# Altium schematic sheet RK3562-PMUIO-OSC-PLL.SchDoc
size 420 x 297 mm; SheetNumber: 6; SheetTotal: 32
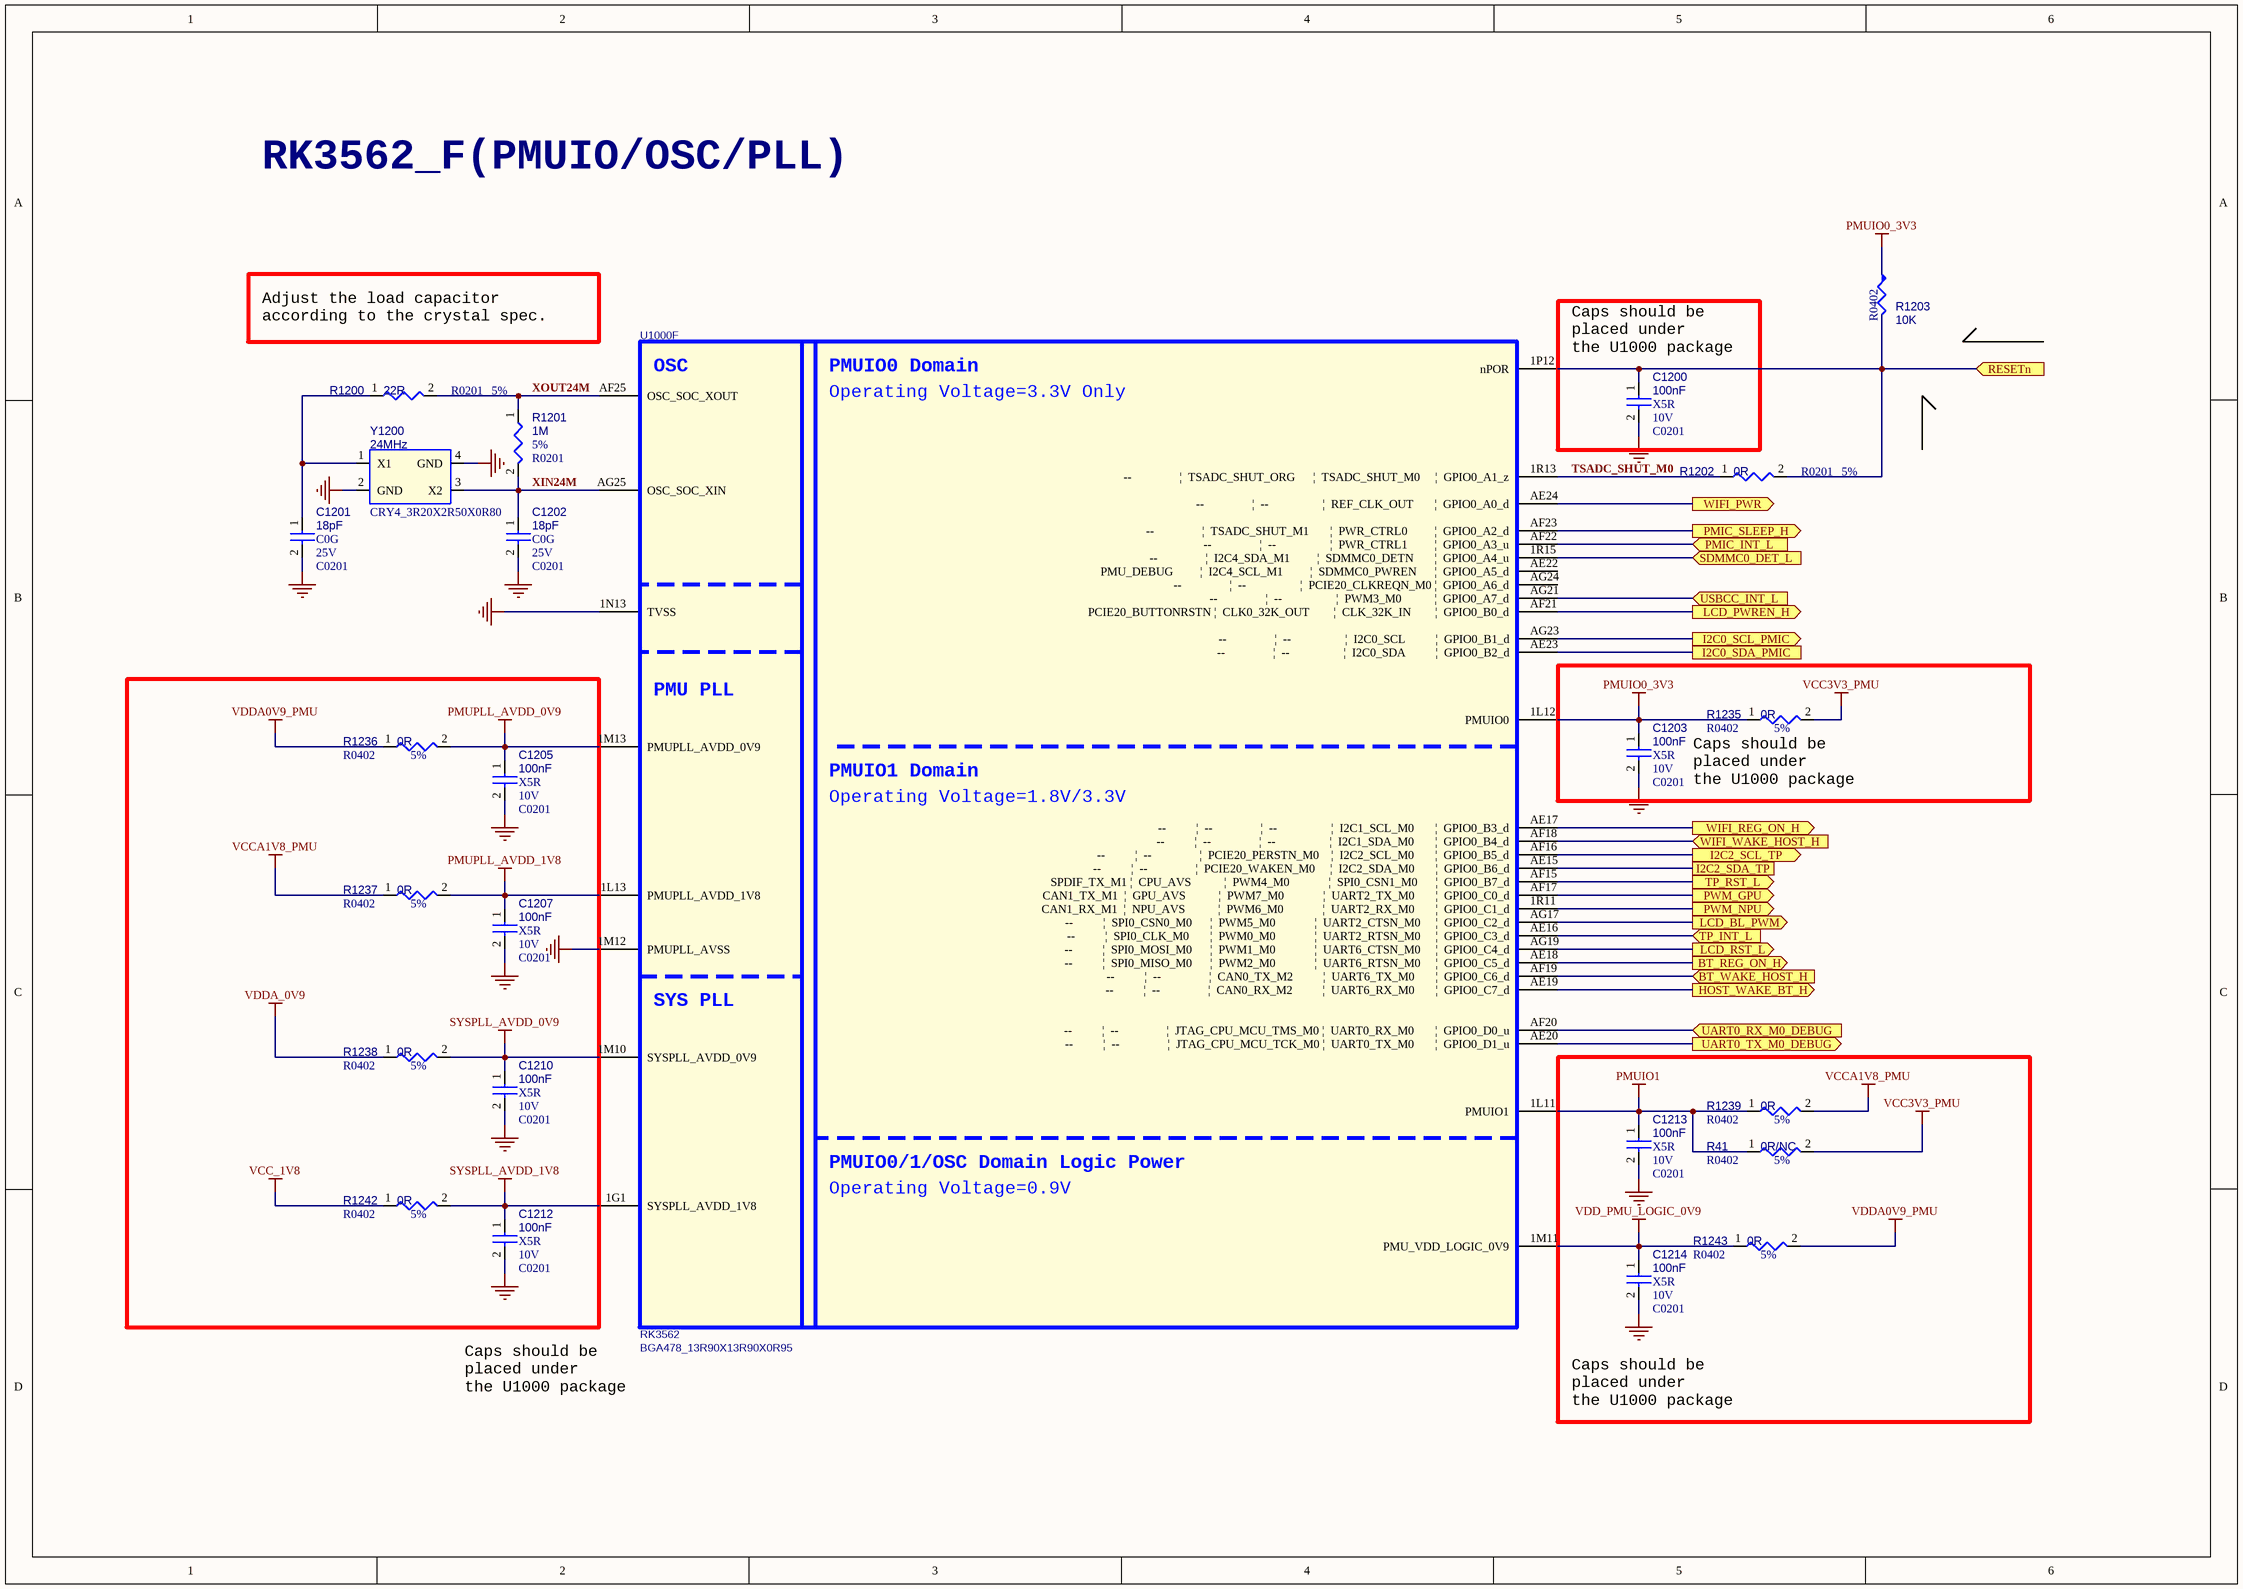
[diagram p0: RK3562-PMUIO-OSC-PLL.SchDoc]

## Parts
C1200  100nF  Dielectric: X5R  Voltage: 10V  [C0201]
C1201  18pF  Dielectric: C0G  Voltage: 25V  [C0201]
C1202  18pF  Dielectric: C0G  Voltage: 25V  [C0201]
C1203  100nF  Dielectric: X5R  Voltage: 10V  [C0201]
C1205  100nF  Dielectric: X5R  Voltage: 10V  [C0201]
C1207  100nF  Dielectric: X5R  Voltage: 10V  [C0201]
C1210  100nF  Dielectric: X5R  Voltage: 10V  [C0201]
C1212  100nF  Dielectric: X5R  Voltage: 10V  [C0201]
C1213  100nF  Dielectric: X5R  Voltage: 10V  [C0201]
C1214  100nF  Dielectric: X5R  Voltage: 10V  [C0201]
R41  0R/NC  Tolerance: 5%  [R0402]
R1200  22R  Tolerance: 5%  [R0201]
R1201  1M  Tolerance: 5%  [R0201]
R1202  0R  Tolerance: 5%  [R0201]
R1203  10K  [R0402]
R1235  0R  Tolerance: 5%  [R0402]
R1236  0R  Tolerance: 5%  [R0402]
R1237  0R  Tolerance: 5%  [R0402]
R1238  0R  Tolerance: 5%  [R0402]
R1239  0R  Tolerance: 5%  [R0402]
R1242  0R  Tolerance: 5%  [R0402]
R1243  0R  Tolerance: 5%  [R0402]
U1000  RK3562  [BGA478_13R90X13R90X0R95]  (part F of 16)
Y1200  24MHz  [CRY4_3R20X2R50X0R80]

## Ports
BT_REG_ON_H (out, see CONTROLLER-RK3562[6A], CONTROLLER-RK3562[7A], WF-BT-AP6256[1A]), BT_WAKE_HOST_H (in, see CONTROLLER-RK3562[6A], CONTROLLER-RK3562[7A], WF-BT-AP6256[1A]), HOST_WAKE_BT_H (out, see CONTROLLER-RK3562[6A], CONTROLLER-RK3562[7A], WF-BT-AP6256[1A]), I2C0_SCL_PMIC (out, see CONTROLLER-RK3562[6A], RK-POWER-SUPPLY[1A]), I2C0_SDA_PMIC (see CONTROLLER-RK3562[6A], RK-POWER-SUPPLY[1A]), I2C2_SCL_TP (out, see CONTROLLER-RK3562[6A]), I2C2_SDA_TP (see CONTROLLER-RK3562[6A]), LCD_BL_PWM (out, see CONTROLLER-RK3562[6A]), LCD_PWREN_H (out, see CONTROLLER-RK3562[6A]), LCD_RST_L (out, see CONTROLLER-RK3562[6A]), PMIC_INT_L (in, see CONTROLLER-RK3562[6A], RK-POWER-SUPPLY[1A]), PMIC_SLEEP_H (out, see CONTROLLER-RK3562[6A], RK-POWER-SUPPLY[1A]), PWM_GPU (out, see CONTROLLER-RK3562[6A]), PWM_NPU (out, see CONTROLLER-RK3562[6A], RK-PERIPHERAL-POWER[2A]), RESETn (in, see CONTROLLER-RK3562[6A], RK-POWER-SUPPLY[1A]), SDMMC0_DET_L (in, see CONTROLLER-RK3562[6A], SD_TF-CARD[1A]), TP_INT_L (in, see CONTROLLER-RK3562[6A]), TP_RST_L (out, see CONTROLLER-RK3562[6A]), UART0_RX_M0_DEBUG (in, see CONTROLLER-RK3562[6A]), UART0_TX_M0_DEBUG (out, see CONTROLLER-RK3562[6A]), USBCC_INT_L (in, see CONTROLLER-RK3562[6A]), WIFI_PWR (out, see CONTROLLER-RK3562[6A]), WIFI_REG_ON_H (out, see CONTROLLER-RK3562[6A], CONTROLLER-RK3562[7A], WF-BT-AP6256[1A]), WIFI_WAKE_HOST_H (in, see CONTROLLER-RK3562[6A], CONTROLLER-RK3562[7A], WF-BT-AP6256[1A])

## Nets
GND: C1200.2 C1201.2 C1202.2 C1203.2 C1205.2 C1207.2 C1210.2 C1212.2 C1213.2 C1214.2 U1000.1M12(PMUPLL_AVSS) U1000.1N13(TVSS) Y1200.2(GND) Y1200.4(GND)
PMUIO0_3V3: C1203.1 R1203.1 R1235.1 U1000.1L12(PMUIO0)
PMUIO1: C1213.1 R41.1 R1239.1 U1000.1L11(PMUIO1)
PMUPLL_AVDD_0V9: C1205.1 R1236.2 U1000.1M13(PMUPLL_AVDD_0V9)
PMUPLL_AVDD_1V8: C1207.1 R1237.2 U1000.1L13(PMUPLL_AVDD_1V8)
SYSPLL_AVDD_0V9: C1210.1 R1238.2 U1000.1M10(SYSPLL_AVDD_0V9)
SYSPLL_AVDD_1V8: C1212.1 R1242.2 U1000.1G1(SYSPLL_AVDD_1V8)
VCC3V3_PMU: R41.2 R1235.2
VCC_1V8: R1242.1
VCCA1V8_PMU: R1237.1 R1239.2
VDD_PMU_LOGIC_0V9: C1214.1 R1243.1 U1000.1M11(PMU_VDD_LOGIC_0V9)
VDDA0V9_PMU: R1236.1 R1243.2
VDDA_0V9: R1238.1
BT_REG_ON_H: U1000.AE18(--__________|__SPI0_MISO_M0______|__PWM2_M0_____________|__UART6_RTSN_M0_____|__GPIO0_C5_d) ; port BT_REG_ON_H
BT_WAKE_HOST_H: U1000.AF19(--__________|__--________________|__CAN0_TX_M2__________|__UART6_TX_M0_______|__GPIO0_C6_d) ; port BT_WAKE_HOST_H
HOST_WAKE_BT_H: U1000.AE19(--__________|__--________________|__CAN0_RX_M2__________|__UART6_RX_M0_______|__GPIO0_C7_d) ; port HOST_WAKE_BT_H
I2C0_SCL_PMIC: U1000.AG23(--________________|__--__________________|__I2C0_SCL__________|__GPIO0_B1_d) ; port I2C0_SCL_PMIC
I2C0_SDA_PMIC: U1000.AE23(--________________|__--__________________|__I2C0_SDA__________|__GPIO0_B2_d) ; port I2C0_SDA_PMIC
I2C2_SCL_TP: U1000.AF16(--__________|__--________________|__PCIE20_PERSTN_M0____|__I2C2_SCL_M0_______|__GPIO0_B5_d) ; port I2C2_SCL_TP
I2C2_SDA_TP: U1000.AE15(--__________|__--________________|__PCIE20_WAKEN_M0_____|__I2C2_SDA_M0_______|__GPIO0_B6_d) ; port I2C2_SDA_TP
LCD_BL_PWM: U1000.AG17(--__________|__SPI0_CSN0_M0______|__PWM5_M0_____________|__UART2_CTSN_M0_____|__GPIO0_C2_d) ; port LCD_BL_PWM
LCD_PWREN_H: U1000.AF21(PCIE20_BUTTONRSTN_|__CLK0_32K_OUT________|__CLK_32K_IN________|__GPIO0_B0_d) ; port LCD_PWREN_H
LCD_RST_L: U1000.AG19(--__________|__SPI0_MOSI_M0______|__PWM1_M0_____________|__UART6_CTSN_M0_____|__GPIO0_C4_d) ; port LCD_RST_L
PMIC_INT_L: U1000.AF22(--________________|__--__________________|__PWR_CTRL1_________|__GPIO0_A3_u) ; port PMIC_INT_L
PMIC_SLEEP_H: U1000.AF23(--________________|__TSADC_SHUT_M1_______|__PWR_CTRL0_________|__GPIO0_A2_d) ; port PMIC_SLEEP_H
PWM_GPU: U1000.AF17(CAN1_TX_M1__|__GPU_AVS___________|__PWM7_M0_____________|__UART2_TX_M0_______|__GPIO0_C0_d) ; port PWM_GPU
PWM_NPU: U1000.1R11(CAN1_RX_M1__|__NPU_AVS___________|__PWM6_M0_____________|__UART2_RX_M0_______|__GPIO0_C1_d) ; port PWM_NPU
RESETn: C1200.1 R1202.2 R1203.2 U1000.1P12(nPOR) ; port RESETn
SDMMC0_DET_L: U1000.1R15(--________________|__I2C4_SDA_M1_________|__SDMMC0_DETN_______|__GPIO0_A4_u) ; port SDMMC0_DET_L
TP_INT_L: U1000.AE16(--__________|__SPI0_CLK_M0_______|__PWM0_M0_____________|__UART2_RTSN_M0_____|__GPIO0_C3_d) ; port TP_INT_L
TP_RST_L: U1000.AF15(SPDIF_TX_M1_|__CPU_AVS___________|__PWM4_M0_____________|__SPI0_CSN1_M0______|__GPIO0_B7_d) ; port TP_RST_L
TSADC_SHUT_M0: R1202.1 U1000.1R13(--________________|__TSADC_SHUT_ORG______|__TSADC_SHUT_M0_____|__GPIO0_A1_z)
UART0_RX_M0_DEBUG: U1000.AF20(--__________|__--________________|__JTAG_CPU_MCU_TMS_M0_|__UART0_RX_M0_______|__GPIO0_D0_u) ; port UART0_RX_M0_DEBUG
UART0_TX_M0_DEBUG: U1000.AE20(--__________|__--________________|__JTAG_CPU_MCU_TCK_M0_|__UART0_TX_M0_______|__GPIO0_D1_u) ; port UART0_TX_M0_DEBUG
USBCC_INT_L: U1000.AG21(--________________|__--__________________|__PWM3_M0___________|__GPIO0_A7_d) ; port USBCC_INT_L
WIFI_PWR: U1000.AE24(--________________|__--__________________|__REF_CLK_OUT_______|__GPIO0_A0_d) ; port WIFI_PWR
WIFI_REG_ON_H: U1000.AE17(--__________|__--________________|__--__________________|__I2C1_SCL_M0_______|__GPIO0_B3_d) ; port WIFI_REG_ON_H
WIFI_WAKE_HOST_H: U1000.AF18(--__________|__--________________|__--__________________|__I2C1_SDA_M0_______|__GPIO0_B4_d) ; port WIFI_WAKE_HOST_H
XIN24M: C1202.1 R1201.2 U1000.AG25(OSC_SOC_XIN) Y1200.3(X2)
XOUT24M: R1200.2 R1201.1 U1000.AF25(OSC_SOC_XOUT)
NetC1201_1: C1201.1 R1200.1 Y1200.1(X1)

Not connected (* = marked no-connect by the designer): U1000 AE22(PMU_DEBUG_________|__I2C4_SCL_M1_________|__SDMMC0_PWREN______|__GPIO0_A5_d) AG24(--________________|__--__________________|__PCIE20_CLKREQN_M0_|__GPIO0_A6_d)

## Notes on the sheet
- RK3562_F(PMUIO/OSC/PLL)
- Adjust the load capacitor
  according to the crystal spec.
- Caps should be
  placed under
  the U1000 package
- (near R1235) Caps should be
  placed under
  the U1000 package
- (in symbol SOC_RK3562, part F) OSC; PMUIO0 Domain; Operating Voltage=3.3V Only; PMU PLL; PMUIO1 Domain; Operating Voltage=1.8V/3.3V; SYS PLL; PMUIO0/1/OSC Domain Logic Power; Operating Voltage=0.9V

## Library data of the parts
C1200 = CAP NP: cap,100.00nF,+/-10%,10V,X5R,C0201; Part Reference: C1200; Manufacturer PN: C0603X5R1A104K030BC; Manufacturer: TDK; Tolerance: 10%; Priority: A; PCB Footprint: C0201; Value: 100nF; Created by: JJJ; Part Type: C0201; RK PN: C0603X5R1A104K030BC; ClassName: RK
C1201 = CAP NP: 一般用片状陶瓷电容(GRM),cap,18pF,±5%,25V,C0G,C0201; Part Reference: C1201; Manufacturer PN: GRM0335C1E180JA01; Manufacturer: murata; C_Voltage: 6.3V; Priority: A; RK PN: 902004768; Number: 37; PCB Footprint: C0201; Value: 18pF; Created by: JJJ; Tolerance: ±5%; Part Type: 一般用片状陶瓷电容; ClassName: RK
C1202 = CAP NP: 一般用片状陶瓷电容(GRM),cap,18pF,±5%,25V,C0G,C0201; Part Reference: C1202; Manufacturer: murata; Manufacturer PN: GRM0335C1E180JA01; Number: 37; RK PN: 902004768; Priority: A; C_Voltage: 6.3V; PCB Footprint: C0201; Value: 18pF; Part Type: 一般用片状陶瓷电容; Tolerance: ±5%; Created by: JJJ; ClassName: RK
C1203 = CAP NP: cap,100.00nF,+/-10%,10V,X5R,C0201; Part Reference: C1203; Manufacturer PN: C0603X5R1A104K030BC; Manufacturer: TDK; Tolerance: 10%; Priority: A; PCB Footprint: C0201; Value: 100nF; Created by: JJJ; Part Type: C0201; RK PN: C0603X5R1A104K030BC; ClassName: RK
C1205 = CAP NP: cap,100.00nF,+/-10%,10V,X5R,C0201; Part Reference: C1205; Manufacturer: TDK; RK PN: C0603X5R1A104K030BC; Priority: A; Tolerance: 10%; PCB Footprint: C0201; Value: 100nF; Part Type: C0201; Manufacturer PN: C0603X5R1A104K030BC; Created by: JJJ; ClassName: RK
C1207 = CAP NP: cap,100.00nF,+/-10%,10V,X5R,C0201; Part Reference: C1207; Manufacturer: TDK; RK PN: C0603X5R1A104K030BC; Priority: A; Tolerance: 10%; PCB Footprint: C0201; Value: 100nF; Part Type: C0201; Manufacturer PN: C0603X5R1A104K030BC; Created by: JJJ; ClassName: RK
C1210 = CAP NP: cap,100.00nF,+/-10%,10V,X5R,C0201; Part Reference: C1210; Manufacturer: TDK; RK PN: C0603X5R1A104K030BC; Priority: A; Tolerance: 10%; PCB Footprint: C0201; Value: 100nF; Part Type: C0201; Manufacturer PN: C0603X5R1A104K030BC; Created by: JJJ; ClassName: RK
C1212 = CAP NP: cap,100.00nF,+/-10%,10V,X5R,C0201; Part Reference: C1212; Manufacturer PN: C0603X5R1A104K030BC; Manufacturer: TDK; Tolerance: 10%; Priority: A; PCB Footprint: C0201; Value: 100nF; Created by: JJJ; Part Type: C0201; RK PN: C0603X5R1A104K030BC; ClassName: RK
C1213 = CAP NP: cap,100.00nF,+/-10%,10V,X5R,C0201; Part Reference: C1213; Manufacturer: TDK; RK PN: C0603X5R1A104K030BC; Priority: A; Tolerance: 10%; PCB Footprint: C0201; Value: 100nF; Part Type: C0201; Manufacturer PN: C0603X5R1A104K030BC; Created by: JJJ; ClassName: RK
C1214 = CAP NP: cap,100.00nF,+/-10%,10V,X5R,C0201; Part Reference: C1214; Manufacturer PN: C0603X5R1A104K030BC; Manufacturer: TDK; Tolerance: 10%; Priority: A; PCB Footprint: C0201; Value: 100nF; Created by: JJJ; Part Type: C0201; RK PN: C0603X5R1A104K030BC; ClassName: RK
R41 R1235-R1239 R1242 R1243 = RESISTOR: 通用厚膜电阻,0R,+/-5%,R0402,1/16W.; Part Reference: R1604; Manufacturer PN: RC0402JR-070RL; Manufacturer: YAGEO; Wattage: 1/16W; Priority: A; RK PN: 901001446; PCB Footprint: R0402; Value: 0R; Created by: YTL; Part Type: 通用厚膜电阻; ClassName: RK
R1200 = RESISTOR: 通用厚膜电阻,22R,+/-5%,R0201,1/20W.; Part Reference: R1200; Manufacturer PN: RC0201JR-0722RL; Manufacturer: YAGEO; Wattage: 1/20W; Priority: A; RK PN: 901000523; PCB Footprint: R0201; Value: 22R; Created by: YTL; Part Type: 通用厚膜电阻; ClassName: RK
R1201 = RESISTOR: 通用厚膜电阻,1M,+/-5%,R0201,1/20W.; Part Reference: R1201; Manufacturer PN: RC0201JR-071ML; Manufacturer: YAGEO; Wattage: 1/20W; Priority: A; RK PN: 901000512; PCB Footprint: R0201; Value: 1M; Created by: YTL; Part Type: 通用厚膜电阻; ClassName: RK
R1202 = RESISTOR: 通用厚膜电阻,0R,+/-5%,R0201,1/20W.; Part Reference: R1202; Manufacturer PN: RC0201JR-070RL; Manufacturer: YAGEO; Wattage: 1/20W; Priority: A; RK PN: 901000473; PCB Footprint: R0201; Value: 0R; Created by: YTL; Part Type: 通用厚膜电阻; ClassName: RK
R1203 = RESISTOR5: 通用厚膜电阻,10K,+/-5%,R0402,1/16W.; Part Reference: R2245; Manufacturer PN: RC0402JR-0710KL; Manufacturer: YAGEO; Tolerance: 5%; Wattage: 1/16W; Priority: A; RK PN: 901001449; PCB Footprint: R0402; Value: 10K; Created by: YTL; Part Type: 通用厚膜电阻; ClassName: RK
U1000 = SOC_RK3562: ROCKCHIP SOC; Part Reference: U1000; Manufacturer: Rockchip (瑞芯微); SPLIT_INST: TRUE; SWAP_INFO: (S1+S2+S3+S4+S5+S6+S7+S8+S9+S10+S11+S12+S13+S14+S15+S16); RK PN: 906000425; Priority: A; PCB Footprint: BGA478_13R90X13R90X0R95; Value: RK3562; Part Type: SOC; Manufacturer PN: RK3562; Created by: JJJ; ClassName: RK
Y1200 = CRYSTAL_4P: 无源晶振，24M，3225,±10ppm，8pF，Hosonic; Part Reference: Y1200; Manufacturer PN: E3SB24.0000F08E11; Manufacturer: Hosonic(鸿星电子); Priority: A; PCB Footprint: CRY4_3R20X2R50X0R80; Value: 24MHz; Created by: JJJ; Part Type: CRYSTAL; RK PN: E3SB24.0000F08E11; ClassName: RK